# Altium schematic sheet Power_Supply.schdoc
size A; SheetNumber: 1; SheetTotal: 6
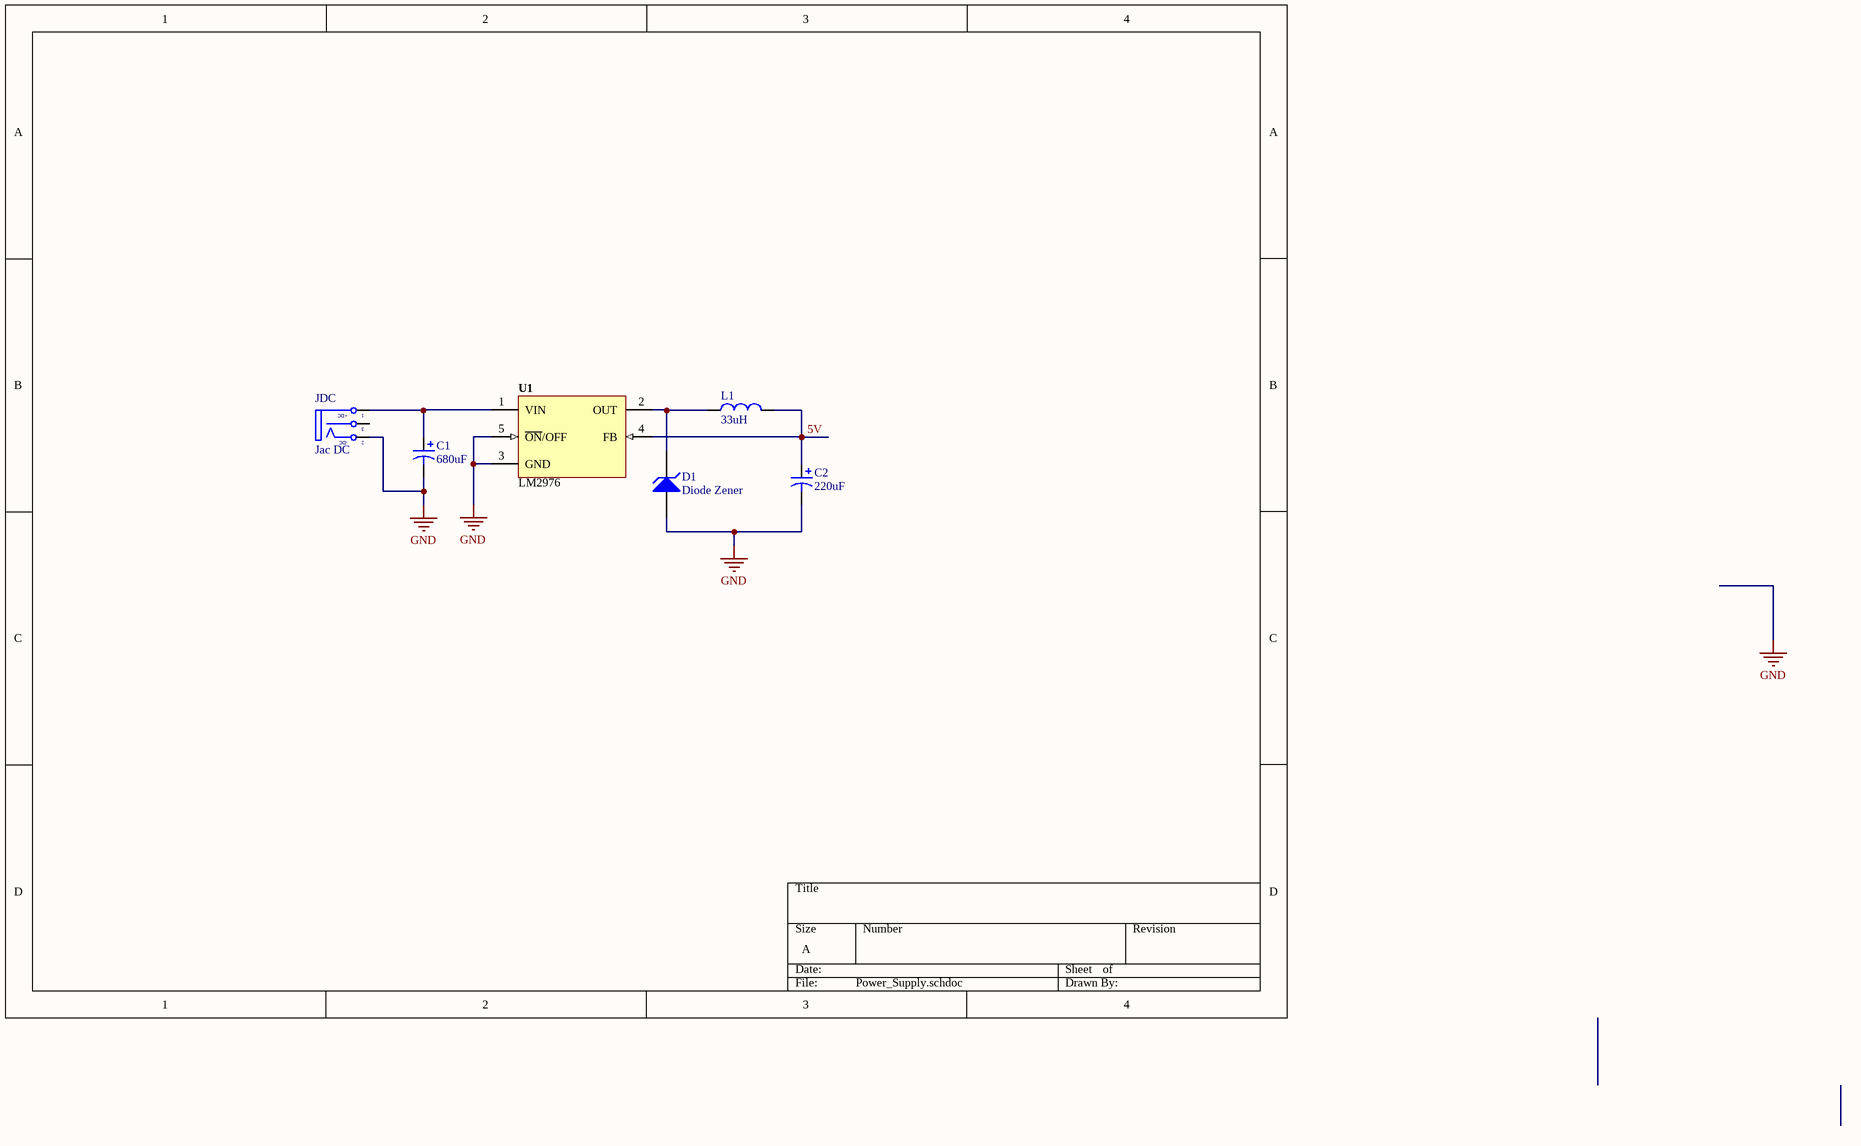
[diagram p0: Power_Supply.schdoc]

## Parts
C1  680uF  [C5mm]
C2  220uF  [C5mm]
D1  Diode Zener  [SMA]
JDC  Jac DC  [DC0]
L1  33uH  [L-SMD-M-7.3x4.5]
U1  LM2976  [TO263]

## Nets
GND: C1.2 C2.2 D1.1(A) JDC.2(TN) U1.3(GND) U1.5(~{ON}/OFF)
5V: C2.1 L1.2 U1.4(FB)
NetC1_1: C1.1 JDC.1(T) U1.1(VIN)
NetD1_2: D1.2(K) L1.1 U1.2(OUT)

Not connected (* = marked no-connect by the designer): JDC 3(S)

## Notes on the sheet
- (in symbol DCIN) +DC; -DC

## Library data of the parts
C1 C2 = Cap Pol 5mm: Polarized Capacitor (Axial); Published: 8-Jun-2000; LatestRevisionDate: 17-Jul-2002; LatestRevisionNote: Re-released for DXP Platform.; PackageReference: POLAR0.8; Publisher: Altium Limited
D1 = Diode Zener: Zener Diode; Published: 8-Jun-2000; LatestRevisionDate: 17-Jul-2002; LatestRevisionNote: Re-released for DXP Platform.; PackageReference: DIODE-0.7; Publisher: Altium Limited
JDC = DCIN: Jac DC input; Value: Jac DC
L1 = L1: Inductor; Value: 150 mH
U1 = LM2596: Max Input Voltage: 12 V; Max Output Current: 3 (6.0 peak) A; Max Output Voltage: mV; Category: IC-Power; Min Input Voltage: mV; Min Output Voltage: mV; Mounting Technology: Surface Mount; Status: Unreleased; Supply Voltage: mV; Temperature Range: -40 to +125 degC